# EAGLE design EEPROM DIP Breakout Jumper (EAGLE 8.4.0)
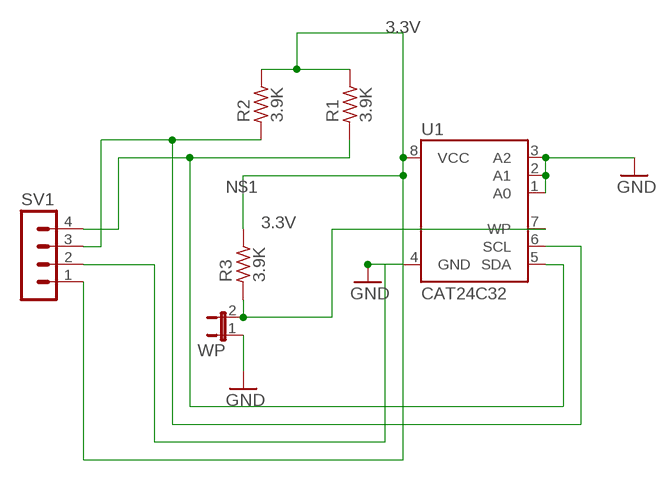
[diagram p0: schematic, sheet 1]

## Parts
R1  3.9K  R_X0204/7  [0204/7]
R2  3.9K  R_X0204/7  [0204/7]
R3  3.9K  R_X0204/7  [0204/7]
SV1  MA04-1  [MA04-1]
U1  CAT24C32  AT24CP  [DIL08]
WP  JP1E  [JP1]

## Nets
3.3V: R1.2 R2.2 R3.2 SV1.1 U1.8(VCC)
GND: SV1.2 U1.1(A0) U1.2(A1) U1.3(A2) U1.4(GND) WP.1
N$1: R1.1 SV1.4 U1.5(SDA)
N$2: R2.1 SV1.3 U1.6(SCL)
N$16: R3.1 U1.7(WP) WP.2

## Library data of the parts
R1-R3 = rc-master:R_: RESISTOR
SV1 = con-lstb:MA04-1: PIN HEADER; OC_FARNELL: unknown; OC_NEWARK: unknown
U1 = atmel:AT24C*: 2-wire serial EEPROM; MPN: AT24C1024BW-SH-B; OC_FARNELL: 1362646; OC_NEWARK: 03P2044
WP = jumper:JP1E: JUMPER

## Board
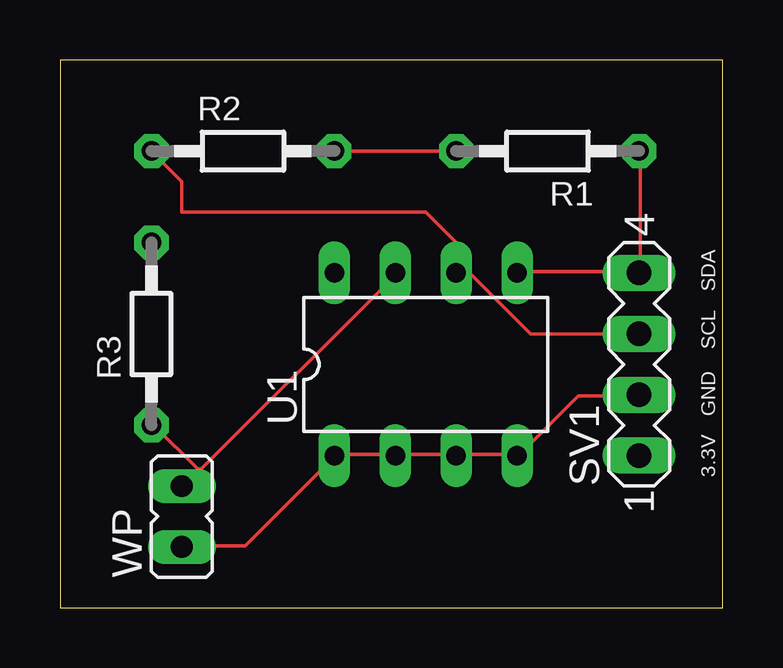
[diagram p1: board, top side]
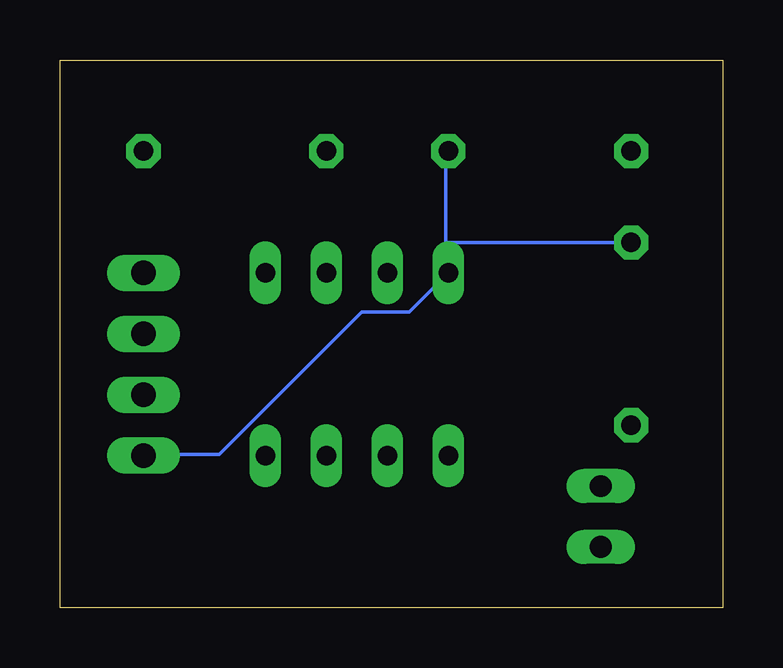
[diagram p2: board, bottom side, seen from below]

Size 27.61 x 22.85 mm. Coordinates in mm from the lower left corner, seen from the top.
Outline: 0,0 27.61,0 27.61,22.85 0,22.85 0,0
Copper layers (1*16): Top 0.035mm / dielectric 1.5mm / Bottom 0.035mm
Design rules "default": minimum track width 6mil, minimum drill 0.35mm, track to track 6mil, track to pad 6mil, pad to pad 6mil, via to via 6mil, smd to smd 6mil, copper to edge 40mil, drill to drill 6mil, minimum pad ring 10mil, minimum via ring 8mil, stop-mask expansion 4mil, vias tented up to drill 0mil, thermal gap 10mil

### Footprints (pad centres in the part's own frame; a part is rotated, then mirrored left to right if it is on the bottom)
0204/7 = drill 0.813 pad 1.422 octagon: 1 -3.81,0; 2 3.81,0
MA04-1 = drill 1.016 long: 1 -3.81,0; 2 -1.27,0; 3 1.27,0; 4 3.81,0
DIL08 = drill 0.813 long: 1 -3.81,-3.81; 2 -1.27,-3.81; 3 1.27,-3.81; 4 3.81,-3.81; 5 3.81,3.81; 6 1.27,3.81; 7 -1.27,3.81; 8 -3.81,3.81
JP1 = drill 0.914 long: 1 0,-1.27; 2 0,1.27

### Placement (x,y rotation side)
R1  20.32,19.05 180 top
R2  7.62,19.05 0 top
R3  3.81,11.43 90 top
SV1  24.13,10.16 90 top
U1  15.24,10.16 0 top
WP  5.08,3.81 0 top

### Tracks (layer width: path | path; a pad name or v marks a point on that pad's centre or on a via)
3.3V
  Top 0.152: R2.2 R1.2
  Bottom 0.152: 11.53,15.24 11.53,19.05 R2.2 | 11.53,15.24 11.53,14.02 U1.8 | U1.8 13.06,12.34 15.04,12.34 20.98,6.4 24.03,6.4 SV1.1 | 11.53,15.24 R3.2 | 11.53,15.24 U1.8
GND
  Top 0.152: SV1.2 24.03,8.84 21.59,8.84 19.15,6.4 U1.4 19,6.4 16.56,6.4 U1.3 16.41,6.4 13.97,6.4 | 13.97,6.4 11.53,6.4 U1.1 11.38,6.25 7.72,2.59 5.13,2.59 WP.1 | 13.97,6.4 U1.2
N$1
  Top 0.152: U1.5 19.15,14.02 24.03,14.02 SV1.4 24.18,14.02 24.18,19.05 R1.1
N$2
  Top 0.152: 16.56,13.87 17.17,13.87 19.61,11.43 SV1.3 | 16.56,13.87 U1.6 16.41,14.02 | R2.1 5.08,17.78 5.08,16.51 15.24,16.51 16.56,15.19 16.56,13.87
N$16
  Top 0.152: 5.89,5.79 5.13,5.03 WP.2 | 5.89,5.79 13.97,13.87 U1.7 | 5.89,5.79 5.74,5.79 3.91,7.62 R3.1

### Text on the board
tPlace: SDA | SCL | GND | 3.3V